# EAGLE design PCBmoteurs (EAGLE 9.3.2)
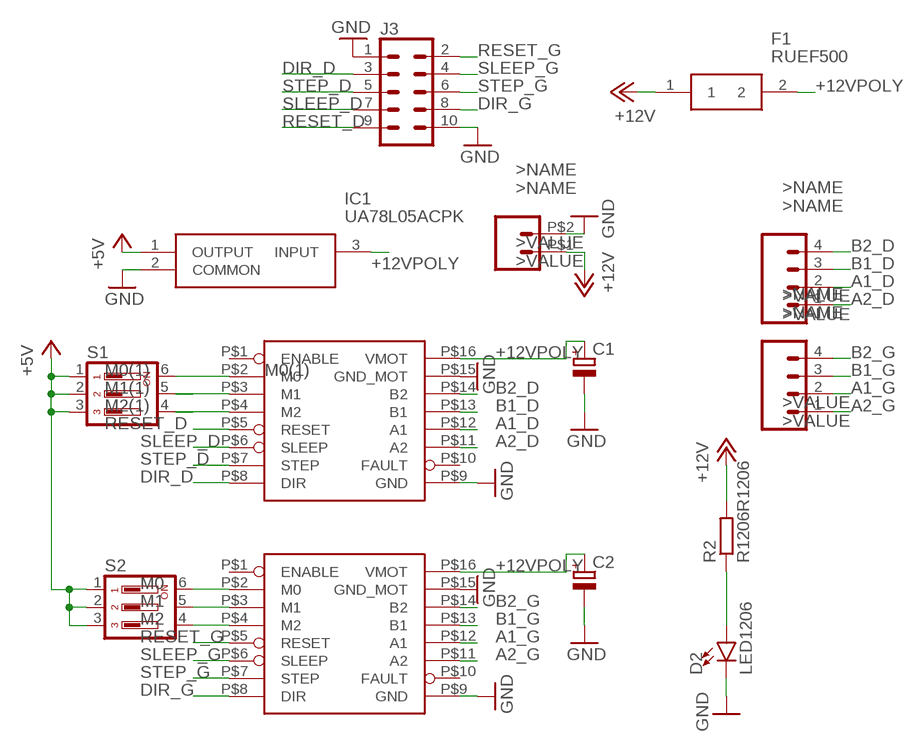
[diagram p0: schematic, sheet 1]

## Parts
C1  CPOL-EUE3.5-8  [E3,5-8]
C2  CPOL-EUE3.5-8  [E3,5-8]
D2  LED1206  [1206]
F1  RUEF500  [RUEF500]
IC1  UA78L05ACPK  [PK(R-PSSO-F3)]
J2  CONN_027A-C  [NSK396-2C]
J3  CONN_05X2SHD  [2X5-SHROUDED]
J4  CONN_04POLAR  [MOLEX-1X4]
J6  CONN_04POLAR  [MOLEX-1X4]
R2  R1206R1206  [R1206]
S1  DS03  [DS-03]
S2  DS03  [DS-03]
U$1  DRV8825  [DRIVER_CARRIER_POLOLU_16]
U$2  DRV8825  [DRIVER_CARRIER_POLOLU_16]

## Nets
+5V: IC1.1(OUTPUT) S1.1 S1.2 S1.3 S2.1 S2.2 S2.3
+12V: F1.1 J2.P$1 R2.2
+12VPOLY: C1.+ C2.+ F1.2 IC1.3(INPUT) U$1.P$16(VMOT) U$2.P$16(VMOT)
A1_D: J4.2 U$1.P$12(A1)
A1_G: J6.2 U$2.P$12(A1)
A2_D: J4.1 U$1.P$11(A2)
A2_G: J6.1 U$2.P$11(A2)
B1_D: J4.3 U$1.P$13(B1)
B1_G: J6.3 U$2.P$13(B1)
B2_D: J4.4 U$1.P$14(B2)
B2_G: J6.4 U$2.P$14(B2)
DIR_D: J3.3 U$1.P$8(DIR)
DIR_G: J3.8 U$2.P$8(DIR)
GND: C1.- C2.- D2.C IC1.2(COMMON) J2.P$2 J3.1 J3.10 U$1.P$9(GND) U$1.P$15(GND_MOT) U$2.P$9(GND) U$2.P$15(GND_MOT)
M0: S2.6 U$2.P$2(M0)
M0(1): S1.6 U$1.P$2(M0)
M1: S2.5 U$2.P$3(M1)
M1(1): S1.5 U$1.P$3(M1)
M2: S2.4 U$2.P$4(M2)
M2(1): S1.4 U$1.P$4(M2)
N$2: D2.A R2.1
RESET_D: J3.9 U$1.P$5(RESET)
RESET_G: J3.2 U$2.P$5(RESET)
SLEEP_D: J3.7 U$1.P$6(SLEEP)
SLEEP_G: J3.4 U$2.P$6(SLEEP)
STEP_D: J3.5 U$1.P$7(STEP)
STEP_G: J3.6 U$2.P$7(STEP)
Unconnected: U$1.P$1(ENABLE) U$1.P$10(FAULT) U$2.P$1(ENABLE) U$2.P$10(FAULT)

## Library data of the parts
C1 C2 = rcl:CPOL-EU: POLARIZED CAPACITOR, European symbol; SPICEPREFIX: C
D2 = AREA:LED1206
F1 = RUEF500:RUEF500: Littelfuse 5A Radial Leaded PCB Mount Resettable Fuse, 30V dc Source: Datasheet <http://www.littelfuse.com/~/media/electronics/product_specifications/resettable_ptcs/littelfuse_ptc_ruef500_product_specification.pdf.pdf>; ARROW_PART_NUMBER: RUEF500; ARROW_PRICE/STOCK: https://www.arrow.com/en/products/ruef500/littelfuse; DESCRIPTION: Littelfuse 5A Radial Leaded PCB Mount Resettable Fuse, 30V dc; HEIGHT: 24mm; MANUFACTURER_NAME: LITTELFUSE; MANUFACTURER_PART_NUMBER: RUEF500; RS_PART_NUMBER: 5176843; RS_PRICE/STOCK: http://uk.rs-online.com/web/p/products/5176843
IC1 = UA78L05ACPK:UA78L05ACPK: 100-mA, 30-V VIN, Positive-Voltage Linear Regulators Source: Datasheet <http://www.ti.com/lit/gpn/ua78l>; DESCRIPTION: 100-mA, 30-V VIN, Positive-Voltage Linear Regulators; HEIGHT: mm; MANUFACTURER_NAME: Texas Instruments; MANUFACTURER_PART_NUMBER: UA78L05ACPK; MOUSER_PART_NUMBER: 595-UA78L05ACPK; MOUSER_PRICE-STOCK: https://www.mouser.com/Search/Refine.aspx?Keyword=595-UA78L05ACPK
J2 = OPENBOT:CONN_02: Multi connection point. Often used as Generic Header-pin footprint for 0.1 inch spaced/style header connections On any of the 0.1 inch spaced packages, you can populate with these: Break Away Headers - Straight <https://www.sparkfun.com/products/116> (PRT-00116) Break Away Male Headers - Right Angle <https://www.sparkfun.com/products/553> (PRT-00553) Female Headers <https://www.sparkfun.com/products/115> (PRT-00115) Break Away Headers - Machine Pin <https://www.sparkfun.com/products/117> (PRT-00117) Break Away Female Headers - Swiss Machine Pin <https://www.sparkfun.com/products/743> (PRT-00743) For SCREWTERMINALS and SPRING TERMINALS visit here: Screw Terimnals on SparkFun.com <https://www.sparkfun.com/search/results?term=Screw+Terminals> (5mm/3.5mm/2.54mm spacing) This device is also useful as a general connection point to wire up your design to another part of your project. Our various solder wires solder well into these plated through hole pads. Hook-Up Wire - Assortment (Stranded, 22 AWG) <https://www.sparkfun.com/products/11375> (PRT-11375) Hook-Up Wire - Assortment (Solid Core, 22 AWG) <https://www.sparkfun.com/products/11367> (PRT-11367) View the entire wire category on our website here <https://www.sparkfun.com/categories/141> Special notes: Molex polarized connector foot print use with: PRT-08233 with associated crimp pins and housings. 2.54_SCREWTERM for use with PRT-10571. 3.5mm Screw Terminal footprints for PRT-08084 5mm Screw Terminal footprints for use with PRT-08432 Multi connection point. Often used as Generic Header-pin footprint for 0.1 inch spaced/style header connections On any of the 0.1 inch spaced packages, you can populate with these: Break Away Headers - Straight <https://www.sparkfun.com/products/116> (PRT-00116) Break Away Male Headers - Right Angle <https://www.sparkfun.com/products/553> (PRT-00553) Female Headers <https://www.sparkfun.com/products/115> (PRT-00115) Break Away Headers - Machine Pin <https://www.sparkfun.com/products/117> (PRT-00117) Break Away Female Headers - Swiss Machine Pin <https://www.sparkfun.com/products/743> (PRT-00743) For SCREWTERMINALS and SPRING TERMINALS visit here: Screw Terimnals on SparkFun.com <https://www.sparkfun.com/search/results?term=Screw+Terminals> (5mm/3.5mm/2.54mm spacing) This device is also useful as a general connection point to wire up your design to another part of your project. Our various solder wires solder well into these plated through hole pads. Hook-Up Wire - Assortment (Stranded, 22 AWG) <https://www.sparkfun.com/products/11375> (PRT-11375) Hook-Up Wire - Assortment (Solid Core, 22 AWG) <https://www.sparkfun.com/products/11367> (PRT-11367) View the entire wire category on our website here <https://www.sparkfun.com/categories/141> Special notes: Molex polarized connector foot print use with: PRT-08233 with associated crimp pins and housings. 2.54_SCREWTERM for use with PRT-10571. 3.5mm Screw Terminal footprints for PRT-08084 5mm Screw Terminal footprints for use with PRT-08432
J3 = OPENBOT:CONN_05X2: Multi connection point. Often used as Generic Header-pin footprint for 0.1 inch spaced/style header connections For AVR SPI programming port, see special device with nice symbol: "AVR_SPI_PROG_5x2.dev" You can populate with any combo of single row headers, but if you'd like an exact match, check these: 2x5 AVR ICSP Male Header <https://www.sparkfun.com/products/778> (PRT-00778) 2x5 Pin Shrouded Header <https://www.sparkfun.com/products/8506> (PRT-08506) On any of the 0.1 inch spaced packages, you can populate with these: Break Away Headers - Straight <https://www.sparkfun.com/products/116> (PRT-00116) Break Away Male Headers - Right Angle <https://www.sparkfun.com/products/553> (PRT-00553) Female Headers <https://www.sparkfun.com/products/115> (PRT-00115) Break Away Headers - Machine Pin <https://www.sparkfun.com/products/117> (PRT-00117) Break Away Female Headers - Swiss Machine Pin <https://www.sparkfun.com/products/743> (PRT-00743) Special note: the shrouded connector mates well with our 5x2 ribbon cables: 2x5 Pin IDC Ribbon Cable <https://www.sparkfun.com/products/8535> (PRT-08535); PROD_ID: CONN-08671; SF_ID: PRT-08506
J4 J6 = OPENBOT:CONN_04: Multi connection point. Often used as Generic Header-pin footprint for 0.1 inch spaced/style header connections On any of the 0.1 inch spaced packages, you can populate with these: Break Away Headers - Straight <https://www.sparkfun.com/products/116> (PRT-00116) Break Away Male Headers - Right Angle <https://www.sparkfun.com/products/553> (PRT-00553) Female Headers <https://www.sparkfun.com/products/115> (PRT-00115) Break Away Headers - Machine Pin <https://www.sparkfun.com/products/117> (PRT-00117) Break Away Female Headers - Swiss Machine Pin <https://www.sparkfun.com/products/743> (PRT-00743) For SCREWTERMINALS and SPRING TERMINALS visit here: Screw Terimnals on SparkFun.com <https://www.sparkfun.com/search/results?term=Screw+Terminals> (5mm/3.5mm/2.54mm spacing) This device is also useful as a general connection point to wire up your design to another part of your project. Our various solder wires solder well into these plated through hole pads. Hook-Up Wire - Assortment (Stranded, 22 AWG) <https://www.sparkfun.com/products/11375> (PRT-11375) Hook-Up Wire - Assortment (Solid Core, 22 AWG) <https://www.sparkfun.com/products/11367> (PRT-11367) View the entire wire category on our website here <https://www.sparkfun.com/categories/141> Special notes: Molex polarized connector foot print use with SKU : PRT-08231 with associated crimp pins and housings. 1MM SMD Version SKU: PRT-10208 Multi connection point. Often used as Generic Header-pin footprint for 0.1 inch spaced/style header connections On any of the 0.1 inch spaced packages, you can populate with these: Break Away Headers - Straight <https://www.sparkfun.com/products/116> (PRT-00116) Break Away Male Headers - Right Angle <https://www.sparkfun.com/products/553> (PRT-00553) Female Headers <https://www.sparkfun.com/products/115> (PRT-00115) Break Away Headers - Machine Pin <https://www.sparkfun.com/products/117> (PRT-00117) Break Away Female Headers - Swiss Machine Pin <https://www.sparkfun.com/products/743> (PRT-00743) For SCREWTERMINALS and SPRING TERMINALS visit here: Screw Terimnals on SparkFun.com <https://www.sparkfun.com/search/results?term=Screw+Terminals> (5mm/3.5mm/2.54mm spacing) This device is also useful as a general connection point to wire up your design to another part of your project. Our various solder wires solder well into these plated through hole pads. Hook-Up Wire - Assortment (Stranded, 22 AWG) <https://www.sparkfun.com/products/11375> (PRT-11375) Hook-Up Wire - Assortment (Solid Core, 22 AWG) <https://www.sparkfun.com/products/11367> (PRT-11367) View the entire wire category on our website here <https://www.sparkfun.com/categories/141> Special notes: Molex polarized connector foot print use with SKU : PRT-08231 with associated crimp pins and housings. 1MM SMD Version SKU: PRT-10208; PROD_ID: CONN-08186; SF_ID: PRT-08231
R2 = AREA:R1206
S1 S2 = switch-dil:DS03: DIL/CODE SWITCH; OC_FARNELL: 1255223; OC_NEWARK: unknown
U$1 U$2 = KARIBOUS:DRV8825

## Net classes
0 default: width 0.508 mm

## Board
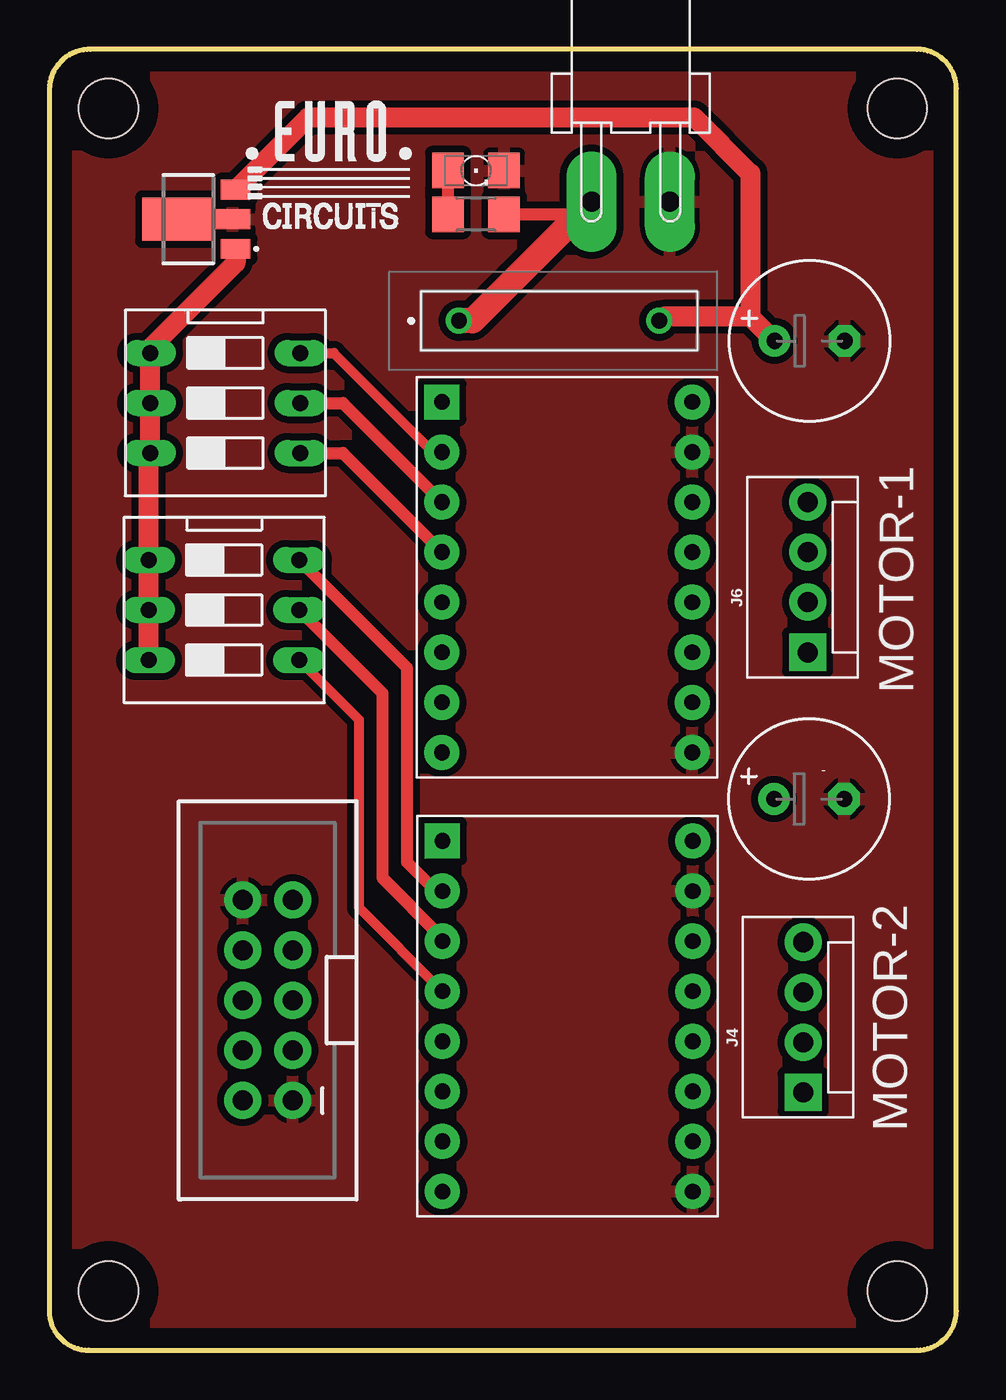
[diagram p1: board, top side]
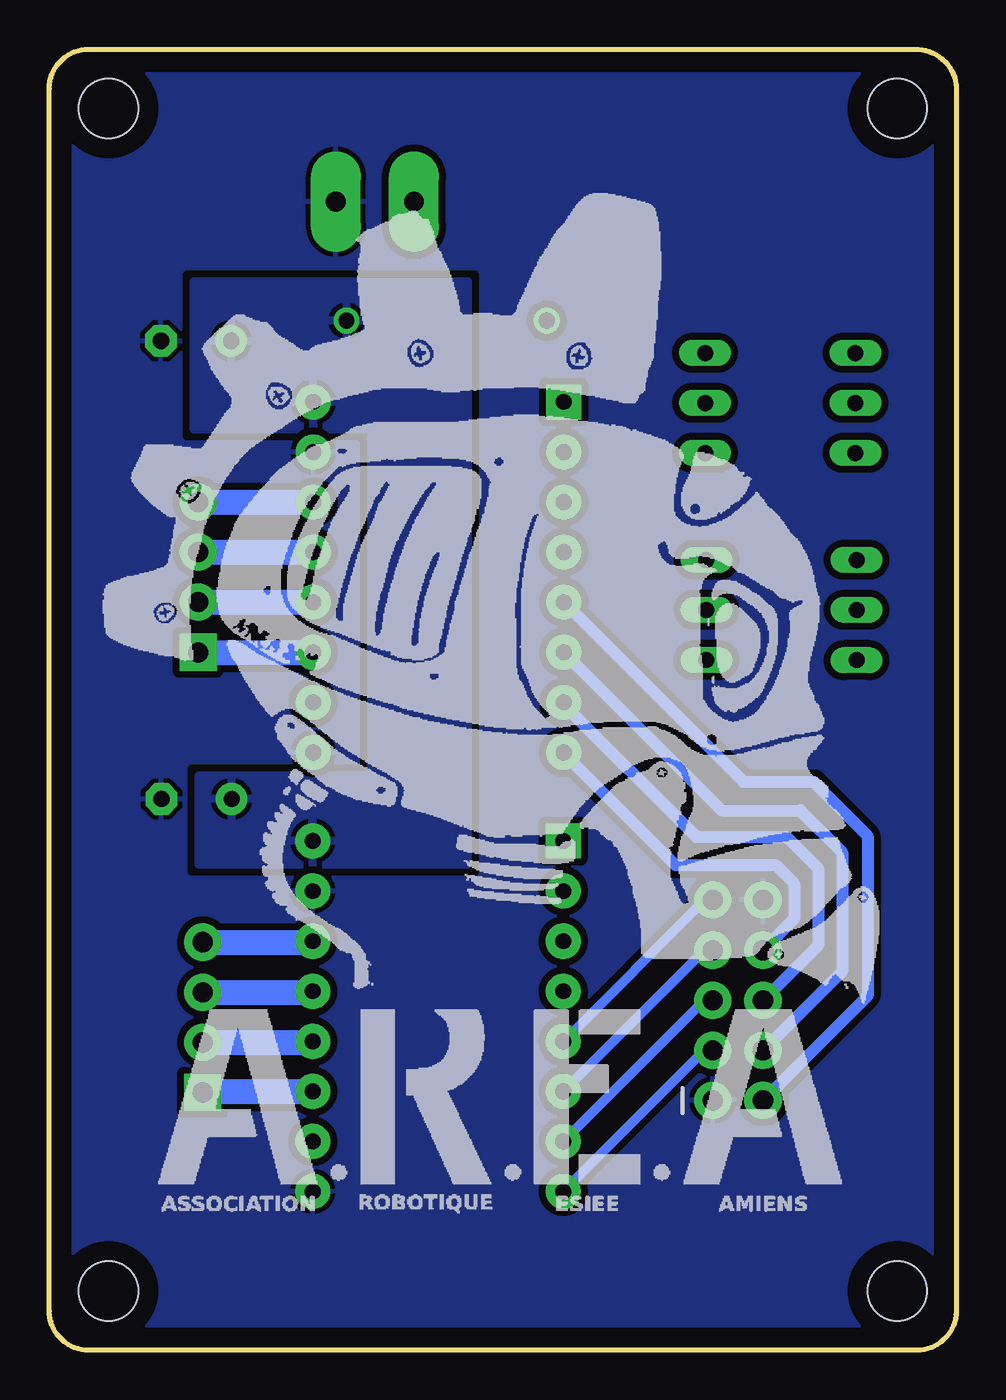
[diagram p2: board, bottom side, seen from below]

Size 46 x 66 mm. Coordinates in mm from the lower left corner, seen from the top.
Outline: 2.1,66 arc90 0,64 0,2 arc90 2,0 44,0 arc90 46,2 46,64 arc90 44,66 2.1,66
Copper layers (1*16): Top 0.035mm / dielectric 1.5mm / Bottom 0.035mm
Design rules "default *": minimum track width 12mil, minimum drill 0.35mm, track to track 14mil, track to pad 12mil, pad to pad 12mil, via to via 12mil, smd to smd 10mil, copper to edge 40mil, drill to drill 6mil, minimum pad ring 10mil, minimum via ring 8mil, stop-mask expansion 4mil, vias tented up to drill 0mil, thermal gap 10mil
Holes 3 mm at 43,3 3,3 3,63 43,63

### Footprints (pad centres in the part's own frame; a part is rotated, then mirrored left to right if it is on the bottom)
E3,5-8 = drill 0.813 pad 1.6: + -1.778,0 | drill 0.813 pad 1.6 octagon: - 1.778,0
1206 = smd 1.6 x 1.803: A -1.422,0; C 1.422,0
RUEF500 = drill 0.81 pad 1.316: 1 -4.775,0; 2 5.375,0
PK(R-PSSO-F3) = smd 1 x 1.5: 1 -1.5,-3.65; 3 1.5,-3.65 | smd 1 x 1.8: 2 0,-3.5 | smd 2.2 x 3.7: 4 0,-0.75
NSK396-2C = drill 1 pad 2.54 long: P$1 -1.98,0; P$2 1.98,0
2X5-SHROUDED = drill 1.016 pad 1.88: 1 -1.27,5.08; 2 1.27,5.08; 3 -1.27,2.54; 4 1.27,2.54; 5 -1.27,0; 6 1.27,0; 7 -1.27,-2.54; 8 1.27,-2.54; 9 -1.27,-5.08; 10 1.27,-5.08
MOLEX-1X4 = drill 1.016 pad 1.88 square: 1 0,0 | drill 1.016 pad 1.88: 2 2.54,0; 3 5.08,0; 4 7.62,0
R1206 = smd 1.6 x 1.803: 1 -1.422,0; 2 1.422,0
DS-03 = drill 0.813 long: 1 -2.54,-3.81; 2 0,-3.81; 3 2.54,-3.81; 4 2.54,3.81; 5 0,3.81; 6 -2.54,3.81
DRIVER_CARRIER_POLOLU_16 = drill 0.8 pad 1.778 square: P$1 0,0 | drill 0.8 pad 1.778: P$2 0,-2.54; P$3 0,-5.08; P$4 0,-7.62; P$5 0,-10.16; P$6 0,-12.7; P$7 0,-15.24; P$8 0,-17.78; P$9 12.7,-17.78; P$10 12.7,-15.24; P$11 12.7,-12.7; P$12 12.7,-10.16; P$13 12.7,-7.62; P$14 12.7,-5.08; P$15 12.7,-2.54; P$16 12.7,0

### Placement (x,y rotation side)
C1  38.53,27.97 0 top
C2  38.56,51.21 0 top
D2  21.64,59.84 0 top
F1  25.55,52.22 0 top
IC1  5.8,57.38 90 top
J2  29.49,58.27 0 top
J3  11.07,17.75 180 top
J4  38.23,13.08 90 top
J6  38.46,35.41 90 top
R2  21.64,57.63 0 top
S1  8.86,37.55 270 top
S2  8.93,48.06 270 top
U$1  19.94,25.83 0 top
U$2  19.91,48.11 0 top

### Tracks (layer width: path | path; a pad name or v marks a point on that pad's centre or on a via)
+5V
  Top 1.016: IC1.1 9.45,55.17 5.12,50.84 S2.1 S2.2 S2.3 5.05,45.45 S1.1 S1.2 S1.3
+12V
  Top 0.61: R2.2 26.87,57.63
  Top 1.27: 26.87,57.63 J2.P$1 21.46,52.22 F1.1
+12VPOLY
  Top 1.016: IC1.3 13.12,62.55 32.7,62.55 35.56,59.69 35.56,52.43 | 35.56,52.43 C2.+ | 35.56,52.43 31.13,52.43 F1.2
  pour Bottom: 24.77,24.64 24.77,54.22 38.7,54.22 38.7,46.72 29.69,46.72 29.69,29.15 38.44,29.15 38.44,24.64
A1_D
  Bottom 1.27: J4.2 32.69,15.62 U$1.P$12
A1_G
  Bottom 1.27: J6.2 U$2.P$12
A2_D
  Bottom 1.27: U$1.P$11 38.18,13.13 J4.1
A2_G
  Bottom 1.27: J6.1 U$2.P$11
B1_D
  Bottom 1.27: U$1.P$13 32.69,18.16 J4.3
B1_G
  Bottom 1.27: J6.3 U$2.P$13
B2_D
  Bottom 1.27: J4.4 32.69,20.7 U$1.P$14
B2_G
  Bottom 1.27: J6.4 U$2.P$14
DIR_D
  Bottom 0.508: U$1.P$8 12.78,15.21 J3.3
DIR_G
  Bottom 0.61: J3.8 8.23,21.87 8.23,23.67 9.17,24.61 14.25,24.61 19.91,30.28 U$2.P$8
GND
  pour Top: -1.68,68.63 50.24,68.63 50.24,0.15 -1.68,0.15
  pour Bottom (rank 2): -1.6,71.53 50.6,71.53 50.6,-3.38 -1.6,-3.38
M0
  Top 0.508: U$2.P$2 19.46,45.57 14.43,50.6 S2.6
M0(1)
  Top 0.61: S1.6 18.14,34.63 18.14,24.76 19.61,23.29 U$1.P$2
M1
  Top 0.61: U$2.P$3 14.88,48.06 S2.5
M1(1)
  Top 0.61: S1.5 16.89,33.34 16.89,23.98 19.94,20.93 U$1.P$3
M2
  Top 0.61: U$2.P$4 14.88,45.52 S2.4
M2(1)
  Top 0.508: S1.4 15.7,31.99 15.7,22.45 U$1.P$4
N$2
  Top 0.61: D2.A R2.1
RESET_D
  Bottom 0.508: U$1.P$5 19.91,15.67 12.75,22.84 J3.9
RESET_G
  Bottom 0.61: J3.2 4.5,17.98 4.5,26.09 7.23,28.82 10.78,28.82 U$2.P$5
SLEEP_D
  Bottom 0.508: U$1.P$6 12.78,20.3 J3.7
SLEEP_G
  Bottom 0.61: J3.4 5.79,19.23 5.79,25.27 7.91,27.39 11.9,27.39 U$2.P$6
STEP_D
  Bottom 0.508: U$1.P$7 12.78,17.75 J3.5
STEP_G
  Bottom 0.61: J3.6 7.01,20.55 7.01,24.44 8.61,26.04 13.17,26.04 20,32.87 U$2.P$7

### Text on the board
tNames: MOTOR-1 | MOTOR-2